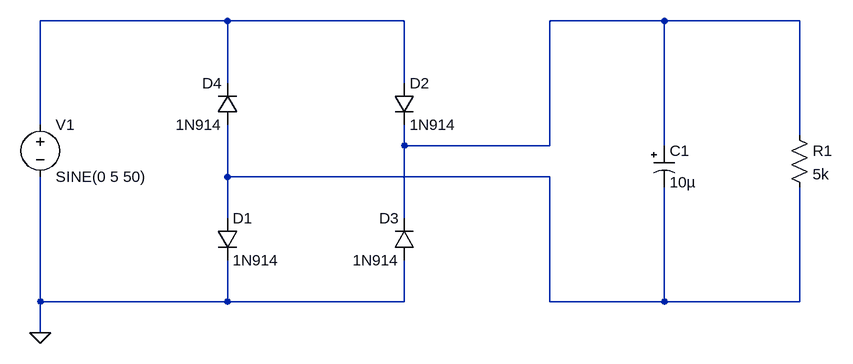
[diagram p0: schematic project.asc]
project.asc, the LTspice schematic file:
Version 4
SHEET 1 1320 680
WIRE 384 -144 96 -144
WIRE 656 -144 384 -144
WIRE 1056 -144 880 -144
WIRE 1264 -144 1056 -144
WIRE 384 -48 384 -144
WIRE 656 -48 656 -144
WIRE 96 16 96 -144
WIRE 1264 32 1264 -144
WIRE 656 48 656 16
WIRE 880 48 880 -144
WIRE 880 48 656 48
WIRE 1056 48 1056 -144
WIRE 384 96 384 16
WIRE 880 96 384 96
WIRE 384 160 384 96
WIRE 656 160 656 48
WIRE 96 288 96 96
WIRE 384 288 384 224
WIRE 384 288 96 288
WIRE 656 288 656 224
WIRE 656 288 384 288
WIRE 880 288 880 96
WIRE 1056 288 1056 112
WIRE 1056 288 880 288
WIRE 1264 288 1264 112
WIRE 1264 288 1056 288
WIRE 96 336 96 288
FLAG 96 336 0
SYMBOL voltage 96 0 R0
WINDOW 123 0 0 Left 2
WINDOW 39 0 0 Left 2
SYMATTR InstName V1
SYMATTR Value SINE(0 5 50)
SYMBOL diode 368 160 R0
SYMATTR InstName D1
SYMATTR Value 1N914
SYMBOL diode 640 -48 R0
SYMATTR InstName D2
SYMATTR Value 1N914
SYMBOL diode 672 224 R180
WINDOW 0 24 64 Left 2
WINDOW 3 24 0 Left 2
SYMATTR InstName D3
SYMATTR Value 1N914
SYMBOL diode 400 16 R180
WINDOW 0 24 64 Left 2
WINDOW 3 24 0 Left 2
SYMATTR InstName D4
SYMATTR Value 1N914
SYMBOL polcap 1040 48 R0
SYMATTR InstName C1
SYMATTR Value 10µ
SYMBOL res 1248 16 R0
SYMATTR InstName R1
SYMATTR Value 5k

The netlist it stands for:
* project.asc
V1 N001 0 SINE(0 5 50)
D1 N003 0 1N914
D2 N001 N002 1N914
D3 0 N002 1N914
D4 N003 N001 1N914
C1 N002 N003 10µ
R1 N002 N003 5k
.model D D
.lib standard.dio
.backanno
.end